# EAGLE schematic ME461_F28379D (EAGLE 7.7.0)

## Sheet 1 of 5
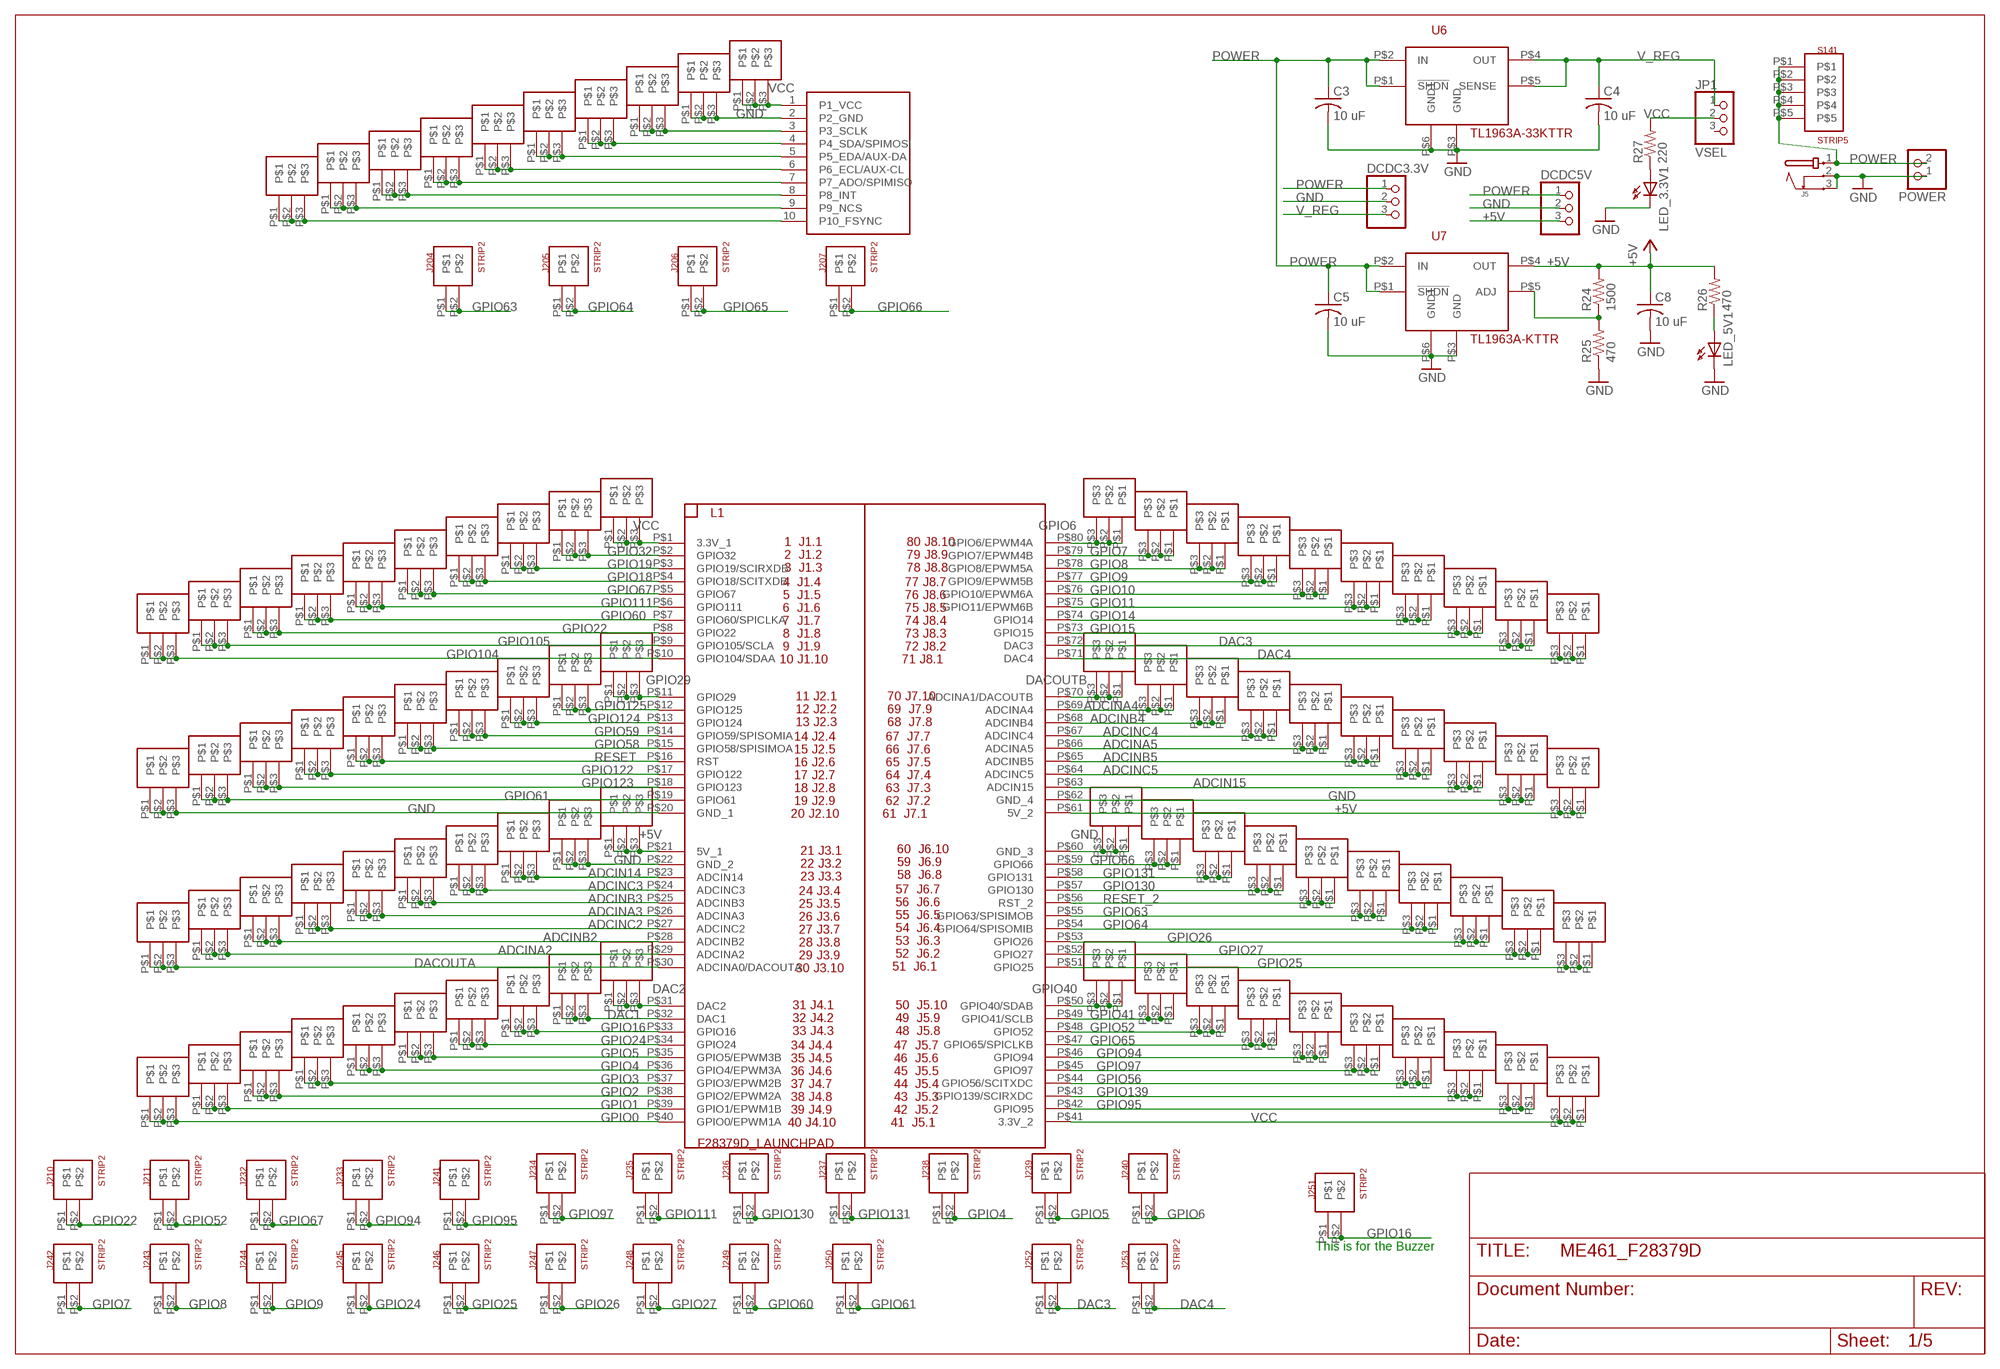
[diagram p0: schematic, sheet 1]

### Parts
C3  10 uF  C-USC1206  [C1206]
C4  10 uF  C-USC1206  [C1206]
C5  10 uF  C-USC1206  [C1206]
C8  10 uF  C-USC1206  [C1206]
DCDC3.3V  PINHD-1X3  [1X03]
DCDC5V  PINHD-1X3  [1X03]
J5  JACK-PMS  [JACK-PMS]
J10  STRIP3  [STRIP3]
J14  STRIP3  [STRIP3]
J15  STRIP3  [STRIP3]
J16  STRIP3  [STRIP3]
J17  STRIP3  [STRIP3]
J18  STRIP3  [STRIP3]
J19  STRIP3  [STRIP3]
J20  STRIP3  [STRIP3]
J21  STRIP3  [STRIP3]
J28  STRIP3  [STRIP3]
J29  STRIP3  [STRIP3]
J30  STRIP3  [STRIP3]
J31  STRIP3  [STRIP3]
J32  STRIP3  [STRIP3]
J33  STRIP3  [STRIP3]
J98  STRIP3  [STRIP3]
J99  STRIP3  [STRIP3]
J100  STRIP3  [STRIP3]
J101  STRIP3  [STRIP3]
J102  STRIP3  [STRIP3]
J103  STRIP3  [STRIP3]
J104  STRIP3  [STRIP3]
J105  STRIP3  [STRIP3]
J106  STRIP3  [STRIP3]
J107  STRIP3  [STRIP3]
J108  STRIP3  [STRIP3]
J109  STRIP3  [STRIP3]
J110  STRIP3  [STRIP3]
J111  STRIP3  [STRIP3]
J112  STRIP3  [STRIP3]
J113  STRIP3  [STRIP3]
J114  STRIP3  [STRIP3]
J115  STRIP3  [STRIP3]
J116  STRIP3  [STRIP3]
J117  STRIP3  [STRIP3]
J118  STRIP3  [STRIP3]
J119  STRIP3  [STRIP3]
J120  STRIP3  [STRIP3]
J121  STRIP3  [STRIP3]
J122  STRIP3  [STRIP3]
J123  STRIP3  [STRIP3]
J124  STRIP3  [STRIP3]
J125  STRIP3  [STRIP3]
J126  STRIP3  [STRIP3]
J127  STRIP3  [STRIP3]
J128  STRIP3  [STRIP3]
J129  STRIP3  [STRIP3]
J130  STRIP3  [STRIP3]
J131  STRIP3  [STRIP3]
J132  STRIP3  [STRIP3]
J133  STRIP3  [STRIP3]
J134  STRIP3  [STRIP3]
J135  STRIP3  [STRIP3]
J136  STRIP3  [STRIP3]
J137  STRIP3  [STRIP3]
J138  STRIP3  [STRIP3]
J139  STRIP3  [STRIP3]
J140  STRIP3  [STRIP3]
J141  STRIP3  [STRIP3]
J142  STRIP3  [STRIP3]
J143  STRIP3  [STRIP3]
J144  STRIP3  [STRIP3]
J145  STRIP3  [STRIP3]
J146  STRIP3  [STRIP3]
J147  STRIP3  [STRIP3]
J148  STRIP3  [STRIP3]
J149  STRIP3  [STRIP3]
J150  STRIP3  [STRIP3]
J151  STRIP3  [STRIP3]
J152  STRIP3  [STRIP3]
J153  STRIP3  [STRIP3]
J154  STRIP3  [STRIP3]
J155  STRIP3  [STRIP3]
J156  STRIP3  [STRIP3]
J157  STRIP3  [STRIP3]
J158  STRIP3  [STRIP3]
J159  STRIP3  [STRIP3]
J160  STRIP3  [STRIP3]
J161  STRIP3  [STRIP3]
J162  STRIP3  [STRIP3]
J163  STRIP3  [STRIP3]
J164  STRIP3  [STRIP3]
J165  STRIP3  [STRIP3]
J166  STRIP3  [STRIP3]
J167  STRIP3  [STRIP3]
J168  STRIP3  [STRIP3]
J169  STRIP3  [STRIP3]
J170  STRIP3  [STRIP3]
J176  STRIP3  [STRIP3]
J177  STRIP3  [STRIP3]
J204  STRIP2  [STRIP2]
J205  STRIP2  [STRIP2]
J206  STRIP2  [STRIP2]
J207  STRIP2  [STRIP2]
J210  STRIP2  [STRIP2]
J211  STRIP2  [STRIP2]
J232  STRIP2  [STRIP2]
J233  STRIP2  [STRIP2]
J234  STRIP2  [STRIP2]
J235  STRIP2  [STRIP2]
J236  STRIP2  [STRIP2]
J237  STRIP2  [STRIP2]
J238  STRIP2  [STRIP2]
J239  STRIP2  [STRIP2]
J240  STRIP2  [STRIP2]
J241  STRIP2  [STRIP2]
J242  STRIP2  [STRIP2]
J243  STRIP2  [STRIP2]
J244  STRIP2  [STRIP2]
J245  STRIP2  [STRIP2]
J246  STRIP2  [STRIP2]
J247  STRIP2  [STRIP2]
J248  STRIP2  [STRIP2]
J249  STRIP2  [STRIP2]
J250  STRIP2  [STRIP2]
J251  STRIP2  [STRIP2]
J252  STRIP2  [STRIP2]
J253  STRIP2  [STRIP2]
JP1  VSEL  PINHD-1X3  [1X03]
L1  F28379D_LAUNCHPAD  [F28379D_LAUNCHPAD]
LED_3.3V1  LED3MM  [LED3MM]
LED_5V1  LED3MM  [LED3MM]
POWER  PINHD-1X2  [1X02]
R24  1500  R-US_M1206  [M1206]
R25  470  R-US_M1206  [M1206]
R26  470  R-US_M1206  [M1206]
R27  220  R-US_M1206  [M1206]
S141  STRIP5  [STRIP5]
U6  TL1963A-33KTTR  [TL1963AKTTR]
U7  TL1963A-KTTR  [TL1963AKTTR]
U$1  MPU-9250-BB  [MPU-9250-BB]

### Nets
+5V [supply]: C8.1 DCDC5V.3 J103.P$1 J103.P$2 J103.P$3 J152.P$1 J152.P$2 J152.P$3 L1.P$21(5V_1) L1.P$61(5V_2) R24.2 R26.2 U7.P$4(OUT) ; also sheet 2,3,5
ADCIN14: J105.P$1 J105.P$2 J105.P$3 L1.P$23(ADCIN14)
ADCIN15: J150.P$1 J150.P$2 J150.P$3 L1.P$63(ADCIN15)
ADCINA2: J111.P$1 J111.P$2 J111.P$3 L1.P$29(ADCINA2)
ADCINA3: J108.P$1 J108.P$2 J108.P$3 L1.P$26(ADCINA3)
ADCINA4: J144.P$1 J144.P$2 J144.P$3 L1.P$69(ADCINA4)
ADCINA5: J147.P$1 J147.P$2 J147.P$3 L1.P$66(ADCINA5)
ADCINB2: J110.P$1 J110.P$2 J110.P$3 L1.P$28(ADCINB2)
ADCINB3: J107.P$1 J107.P$2 J107.P$3 L1.P$25(ADCINB3)
ADCINB4: J145.P$1 J145.P$2 J145.P$3 L1.P$68(ADCINB4)
ADCINB5: J148.P$1 J148.P$2 J148.P$3 L1.P$65(ADCINB5)
ADCINC2: J109.P$1 J109.P$2 J109.P$3 L1.P$27(ADCINC2)
ADCINC3: J106.P$1 J106.P$2 J106.P$3 L1.P$24(ADCINC3)
ADCINC4: J146.P$1 J146.P$2 J146.P$3 L1.P$67(ADCINC4)
ADCINC5: J149.P$1 J149.P$2 J149.P$3 L1.P$64(ADCINC5)
DAC1: J114.P$1 J114.P$2 J114.P$3 L1.P$32(DAC1)
DAC2: J113.P$1 J113.P$2 J113.P$3 L1.P$31(DAC2)
DAC3: J141.P$1 J141.P$2 J141.P$3 J252.P$1 J252.P$2 L1.P$72(DAC3)
DAC4: J142.P$1 J142.P$2 J142.P$3 J253.P$1 J253.P$2 L1.P$71(DAC4)
DACOUTA: J112.P$1 J112.P$2 J112.P$3 L1.P$30(ADCINA0/DACOUTA)
DACOUTB: J143.P$1 J143.P$2 J143.P$3 L1.P$70(ADCINA1/DACOUTB)
GND [supply]: C3.2 C4.2 C5.2 C8.2 DCDC3.3V.2 DCDC5V.2 J5.2 J5.3 J102.P$1 J102.P$2 J102.P$3 J104.P$1 J104.P$2 J104.P$3 J124.P$1 J124.P$2 J124.P$3 J151.P$1 J151.P$2 J151.P$3 J153.P$1 J153.P$2 J153.P$3 L1.P$20(GND_1) L1.P$22(GND_2) L1.P$60(GND_3) L1.P$62(GND_4) LED_3.3V1.K(C) LED_5V1.K(C) POWER.1 R25.1 U6.P$3(GND) U6.P$6(GND1) U7.P$3(GND) U7.P$6(GND1) U$1.2(P2_GND) ; also sheet 2,3,4,5
GPIO0: J122.P$1 J122.P$2 J122.P$3 L1.P$40(GPIO0/EPWM1A)
GPIO1: J121.P$1 J121.P$2 J121.P$3 L1.P$39(GPIO1/EPWM1B)
GPIO2: J120.P$1 J120.P$2 J120.P$3 L1.P$38(GPIO2/EPWM2A) ; also sheet 3
GPIO3: J119.P$1 J119.P$2 J119.P$3 L1.P$37(GPIO3/EPWM2B) ; also sheet 3
GPIO4: J118.P$1 J118.P$2 J118.P$3 J238.P$1 J238.P$2 L1.P$36(GPIO4/EPWM3A)
GPIO5: J117.P$1 J117.P$2 J117.P$3 J239.P$1 J239.P$2 L1.P$35(GPIO5/EPWM3B)
GPIO6: J133.P$1 J133.P$2 J133.P$3 J240.P$1 J240.P$2 L1.P$80(GPIO6/EPWM4A)
GPIO7: J134.P$1 J134.P$2 J134.P$3 J242.P$1 J242.P$2 L1.P$79(GPIO7/EPWM4B)
GPIO8: J135.P$1 J135.P$2 J135.P$3 J243.P$1 J243.P$2 L1.P$78(GPIO8/EPWM5A)
GPIO9: J136.P$1 J136.P$2 J136.P$3 J244.P$1 J244.P$2 L1.P$77(GPIO9/EPWM5B)
GPIO10: J137.P$1 J137.P$2 J137.P$3 L1.P$76(GPIO10/EPWM6A) ; also sheet 3
GPIO11: J138.P$1 J138.P$2 J138.P$3 L1.P$75(GPIO11/EPWM6B) ; also sheet 3
GPIO14: J139.P$1 J139.P$2 J139.P$3 L1.P$74(GPIO14) ; also sheet 3
GPIO15: J140.P$1 J140.P$2 J140.P$3 L1.P$73(GPIO15) ; also sheet 3
GPIO16: J115.P$1 J115.P$2 J115.P$3 J251.P$1 J251.P$2 L1.P$33(GPIO16)
GPIO18: J16.P$1 J16.P$2 J16.P$3 L1.P$4(GPIO18/SCITXDB)
GPIO19: J15.P$1 J15.P$2 J15.P$3 L1.P$3(GPIO19/SCIRXDB)
GPIO22: J20.P$1 J20.P$2 J20.P$3 J210.P$1 J210.P$2 L1.P$8(GPIO22)
GPIO24: J116.P$1 J116.P$2 J116.P$3 J245.P$1 J245.P$2 L1.P$34(GPIO24)
GPIO25: J162.P$1 J162.P$2 J162.P$3 J246.P$1 J246.P$2 L1.P$51(GPIO25)
GPIO26: J160.P$1 J160.P$2 J160.P$3 J247.P$1 J247.P$2 L1.P$53(GPIO26)
GPIO27: J161.P$1 J161.P$2 J161.P$3 J248.P$1 J248.P$2 L1.P$52(GPIO27)
GPIO29: J29.P$1 J29.P$2 J29.P$3 L1.P$11(GPIO29) ; also sheet 3
GPIO32: J14.P$1 J14.P$2 J14.P$3 L1.P$2(GPIO32) ; also sheet 3
GPIO40: J163.P$1 J163.P$2 J163.P$3 L1.P$50(GPIO40/SDAB) ; also sheet 4
GPIO41: J164.P$1 J164.P$2 J164.P$3 L1.P$49(GPIO41/SCLB) ; also sheet 4
GPIO52: J165.P$1 J165.P$2 J165.P$3 J211.P$1 J211.P$2 L1.P$48(GPIO52)
GPIO56: J169.P$1 J169.P$2 J169.P$3 L1.P$44(GPIO56/SCITXDC)
GPIO58: J33.P$1 J33.P$2 J33.P$3 L1.P$15(GPIO58/SPISIMOA)
GPIO59: J32.P$1 J32.P$2 J32.P$3 L1.P$14(GPIO59/SPISOMIA)
GPIO60: J19.P$1 J19.P$2 J19.P$3 J249.P$1 J249.P$2 L1.P$7(GPIO60/SPICLKA)
GPIO61: J101.P$1 J101.P$2 J101.P$3 J250.P$1 J250.P$2 L1.P$19(GPIO61)
GPIO63: J158.P$1 J158.P$2 J158.P$3 J204.P$1 J204.P$2 L1.P$55(GPIO63/SPISIMOB)
GPIO64: J159.P$1 J159.P$2 J159.P$3 J205.P$1 J205.P$2 L1.P$54(GPIO64/SPISOMIB)
GPIO65: J166.P$1 J166.P$2 J166.P$3 J206.P$1 J206.P$2 L1.P$47(GPIO65/SPICLKB)
GPIO66: J154.P$1 J154.P$2 J154.P$3 J207.P$1 J207.P$2 L1.P$59(GPIO66)
GPIO67: J17.P$1 J17.P$2 J17.P$3 J232.P$1 J232.P$2 L1.P$5(GPIO67)
GPIO94: J167.P$1 J167.P$2 J167.P$3 J233.P$1 J233.P$2 L1.P$46(GPIO94)
GPIO95: J176.P$1 J176.P$2 J176.P$3 J241.P$1 J241.P$2 L1.P$42(GPIO95)
GPIO97: J168.P$1 J168.P$2 J168.P$3 J234.P$1 J234.P$2 L1.P$45(GPIO97)
GPIO104: J28.P$1 J28.P$2 J28.P$3 L1.P$10(GPIO104/SDAA)
GPIO105: J21.P$1 J21.P$2 J21.P$3 L1.P$9(GPIO105/SCLA)
GPIO111: J18.P$1 J18.P$2 J18.P$3 J235.P$1 J235.P$2 L1.P$6(GPIO111)
GPIO122: J99.P$1 J99.P$2 J99.P$3 L1.P$17(GPIO122) ; also sheet 5
GPIO123: J100.P$1 J100.P$2 J100.P$3 L1.P$18(GPIO123) ; also sheet 5
GPIO124: J31.P$1 J31.P$2 J31.P$3 L1.P$13(GPIO124) ; also sheet 5
GPIO125: J30.P$1 J30.P$2 J30.P$3 L1.P$12(GPIO125) ; also sheet 5
GPIO130: J156.P$1 J156.P$2 J156.P$3 J236.P$1 J236.P$2 L1.P$57(GPIO130)
GPIO131: J155.P$1 J155.P$2 J155.P$3 J237.P$1 J237.P$2 L1.P$58(GPIO131)
GPIO139: J170.P$1 J170.P$2 J170.P$3 L1.P$43(GPIO139/SCIRXDC)
N$104: R24.1 R25.2 U7.P$5(ADJ)
N$114: LED_5V1.A R26.1
N$117: LED_3.3V1.A R27.1
N$335: J125.P$1 J125.P$2 J125.P$3 U$1.3(P3_SCLK)
N$336: J126.P$1 J126.P$2 J126.P$3 U$1.4(P4_SDA/SPIMOSI)
N$337: J127.P$1 J127.P$2 J127.P$3 U$1.5(P5_EDA/AUX-DA)
N$338: J128.P$1 J128.P$2 J128.P$3 U$1.6(P6_ECL/AUX-CL)
N$339: J129.P$1 J129.P$2 J129.P$3 U$1.7(P7_ADO/SPIMISO)
N$340: J130.P$1 J130.P$2 J130.P$3 U$1.8(P8_INT)
N$341: J131.P$1 J131.P$2 J131.P$3 U$1.9(P9_NCS)
N$342: J132.P$1 J132.P$2 J132.P$3 U$1.10(P10_FSYNC)
POWER [supply]: C3.1 C5.1 DCDC3.3V.1 DCDC5V.1 J5.1 POWER.2 S141.P$1 S141.P$2 S141.P$3 S141.P$4 S141.P$5 U6.P$1(!SHDN) U6.P$2(IN) U7.P$1(!SHDN) U7.P$2(IN) ; also sheet 3,5
RESET: J98.P$1 J98.P$2 J98.P$3 L1.P$16(RST)
RESET_2: J157.P$1 J157.P$2 J157.P$3 L1.P$56(RST_2)
V_REG [supply]: C4.1 DCDC3.3V.3 JP1.1 U6.P$4(OUT) U6.P$5(SENSE)
VCC [supply]: J10.P$1 J10.P$2 J10.P$3 J123.P$1 J123.P$2 J123.P$3 J177.P$1 J177.P$2 J177.P$3 JP1.2 L1.P$1(3.3V_1) L1.P$41(3.3V_2) R27.2 U$1.1(P1_VCC) ; also sheet 2,3,4,5
Unconnected: JP1.3

### Notes on the sheet
- This is for the Buzzer

## Sheet 2 of 5
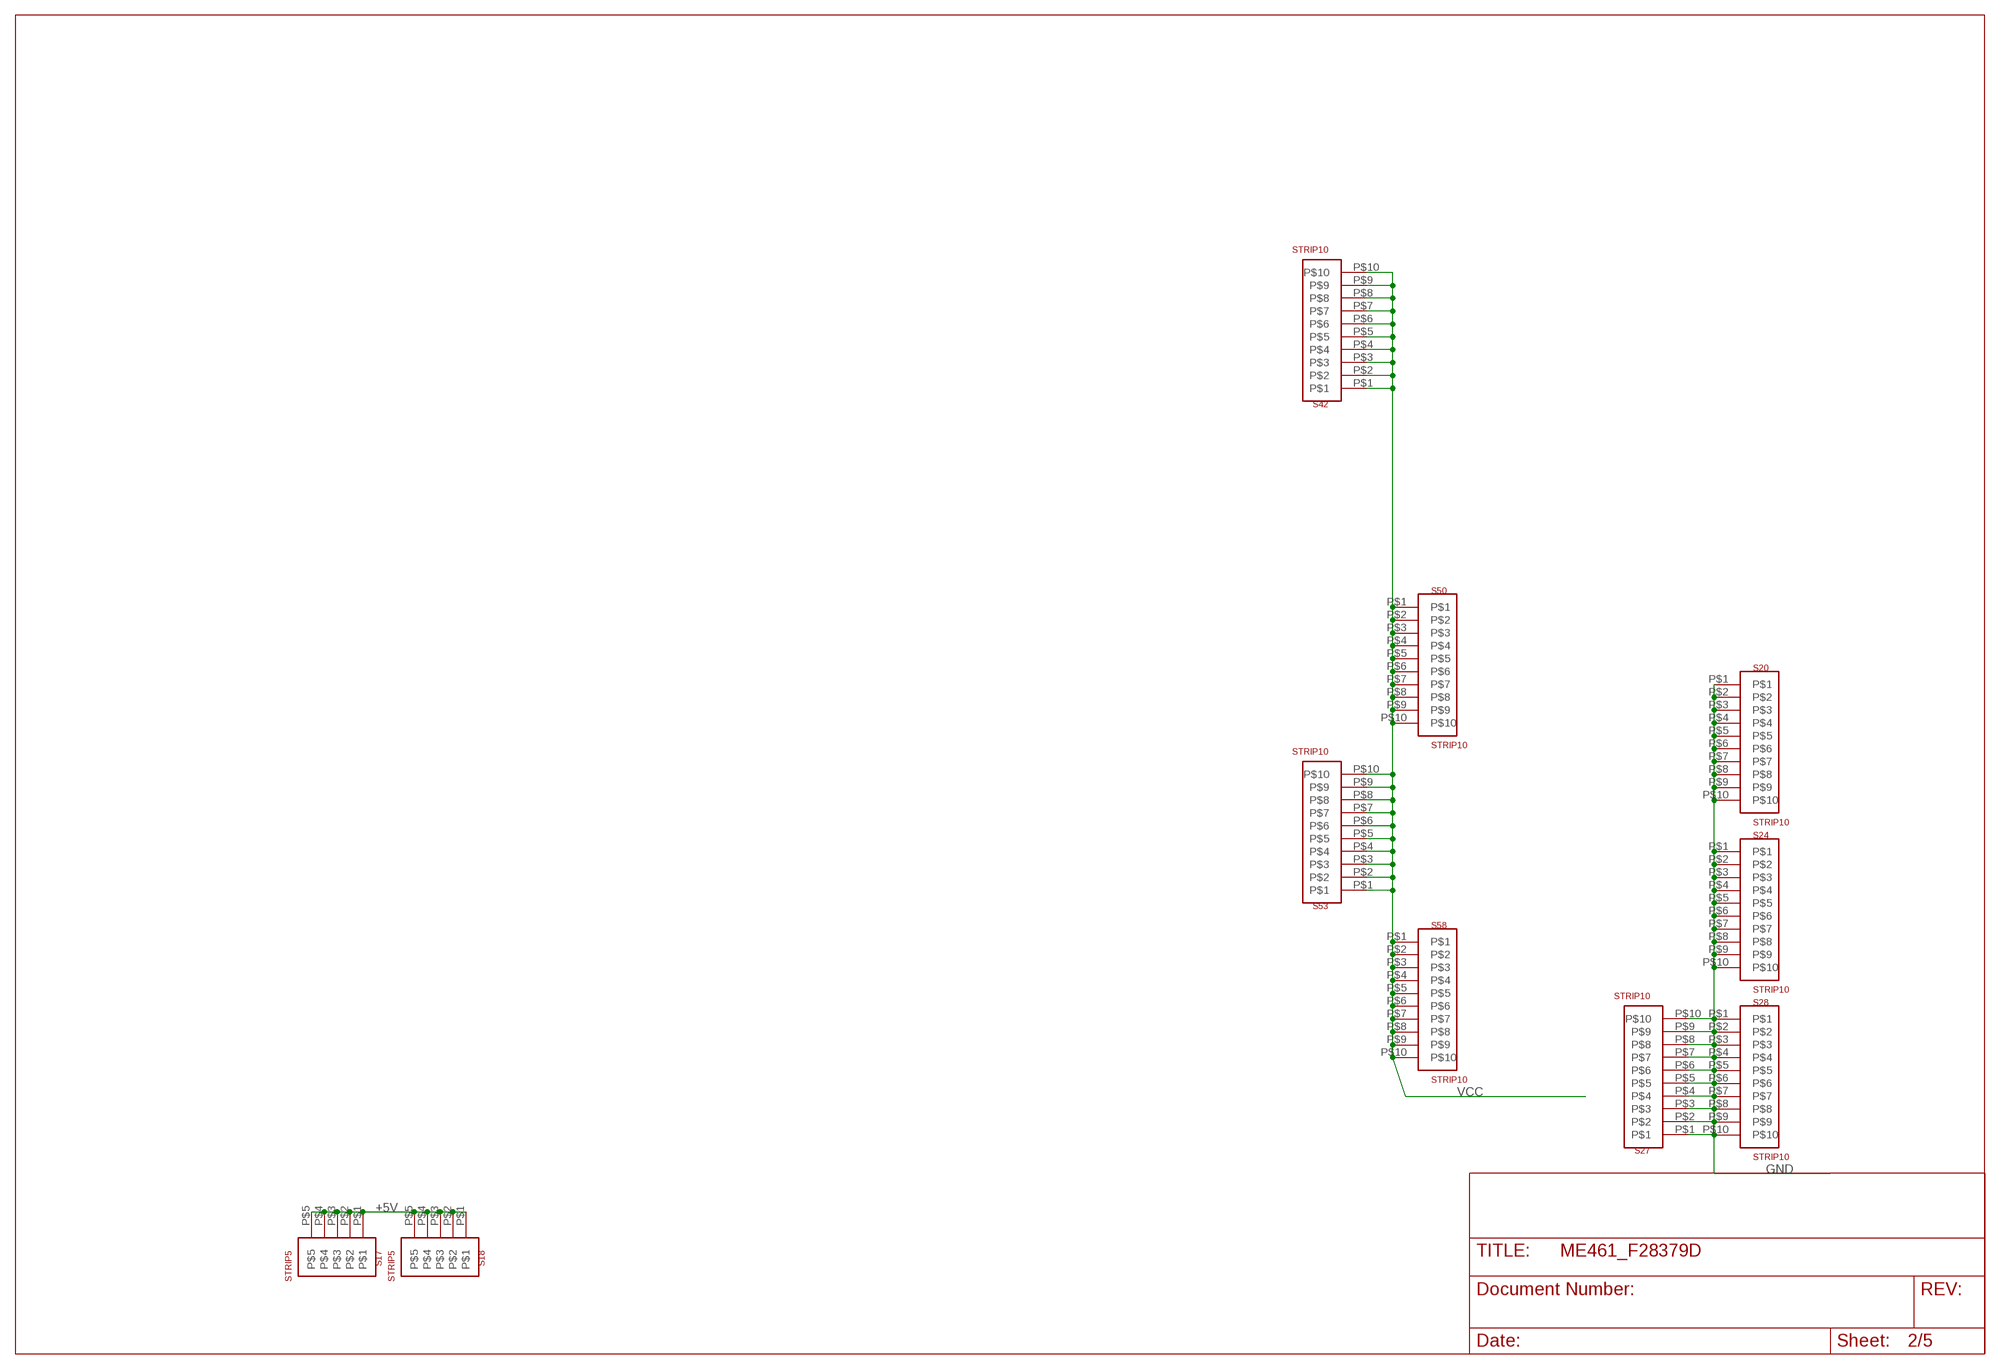
[diagram p1: schematic, sheet 2]

### Parts
S17  STRIP5  [STRIP5]
S18  STRIP5  [STRIP5]
S20  STRIP10  [STRIP10]
S24  STRIP10  [STRIP10]
S27  STRIP10  [STRIP10]
S28  STRIP10  [STRIP10]
S42  STRIP10  [STRIP10]
S50  STRIP10  [STRIP10]
S53  STRIP10  [STRIP10]
S58  STRIP10  [STRIP10]

### Nets
+5V [supply]: S17.P$1 S17.P$2 S17.P$3 S17.P$4 S17.P$5 S18.P$1 S18.P$2 S18.P$3 S18.P$4 S18.P$5 ; also sheet 1,3,5
GND [supply]: S20.P$1 S20.P$2 S20.P$3 S20.P$4 S20.P$5 S20.P$6 S20.P$7 S20.P$8 S20.P$9 S20.P$10 S24.P$1 S24.P$2 S24.P$3 S24.P$4 S24.P$5 S24.P$6 S24.P$7 S24.P$8 S24.P$9 S24.P$10 S27.P$1 S27.P$2 S27.P$3 S27.P$4 S27.P$5 S27.P$6 S27.P$7 S27.P$8 S27.P$9 S27.P$10 S28.P$1 S28.P$2 S28.P$3 S28.P$4 S28.P$5 S28.P$6 S28.P$7 S28.P$8 S28.P$9 S28.P$10 ; also sheet 1,3,4,5
VCC [supply]: S42.P$1 S42.P$2 S42.P$3 S42.P$4 S42.P$5 S42.P$6 S42.P$7 S42.P$8 S42.P$9 S42.P$10 S50.P$1 S50.P$2 S50.P$3 S50.P$4 S50.P$5 S50.P$6 S50.P$7 S50.P$8 S50.P$9 S50.P$10 S53.P$1 S53.P$2 S53.P$3 S53.P$4 S53.P$5 S53.P$6 S53.P$7 S53.P$8 S53.P$9 S53.P$10 S58.P$1 S58.P$2 S58.P$3 S58.P$4 S58.P$5 S58.P$6 S58.P$7 S58.P$8 S58.P$9 S58.P$10 ; also sheet 1,3,4,5

## Sheet 3 of 5
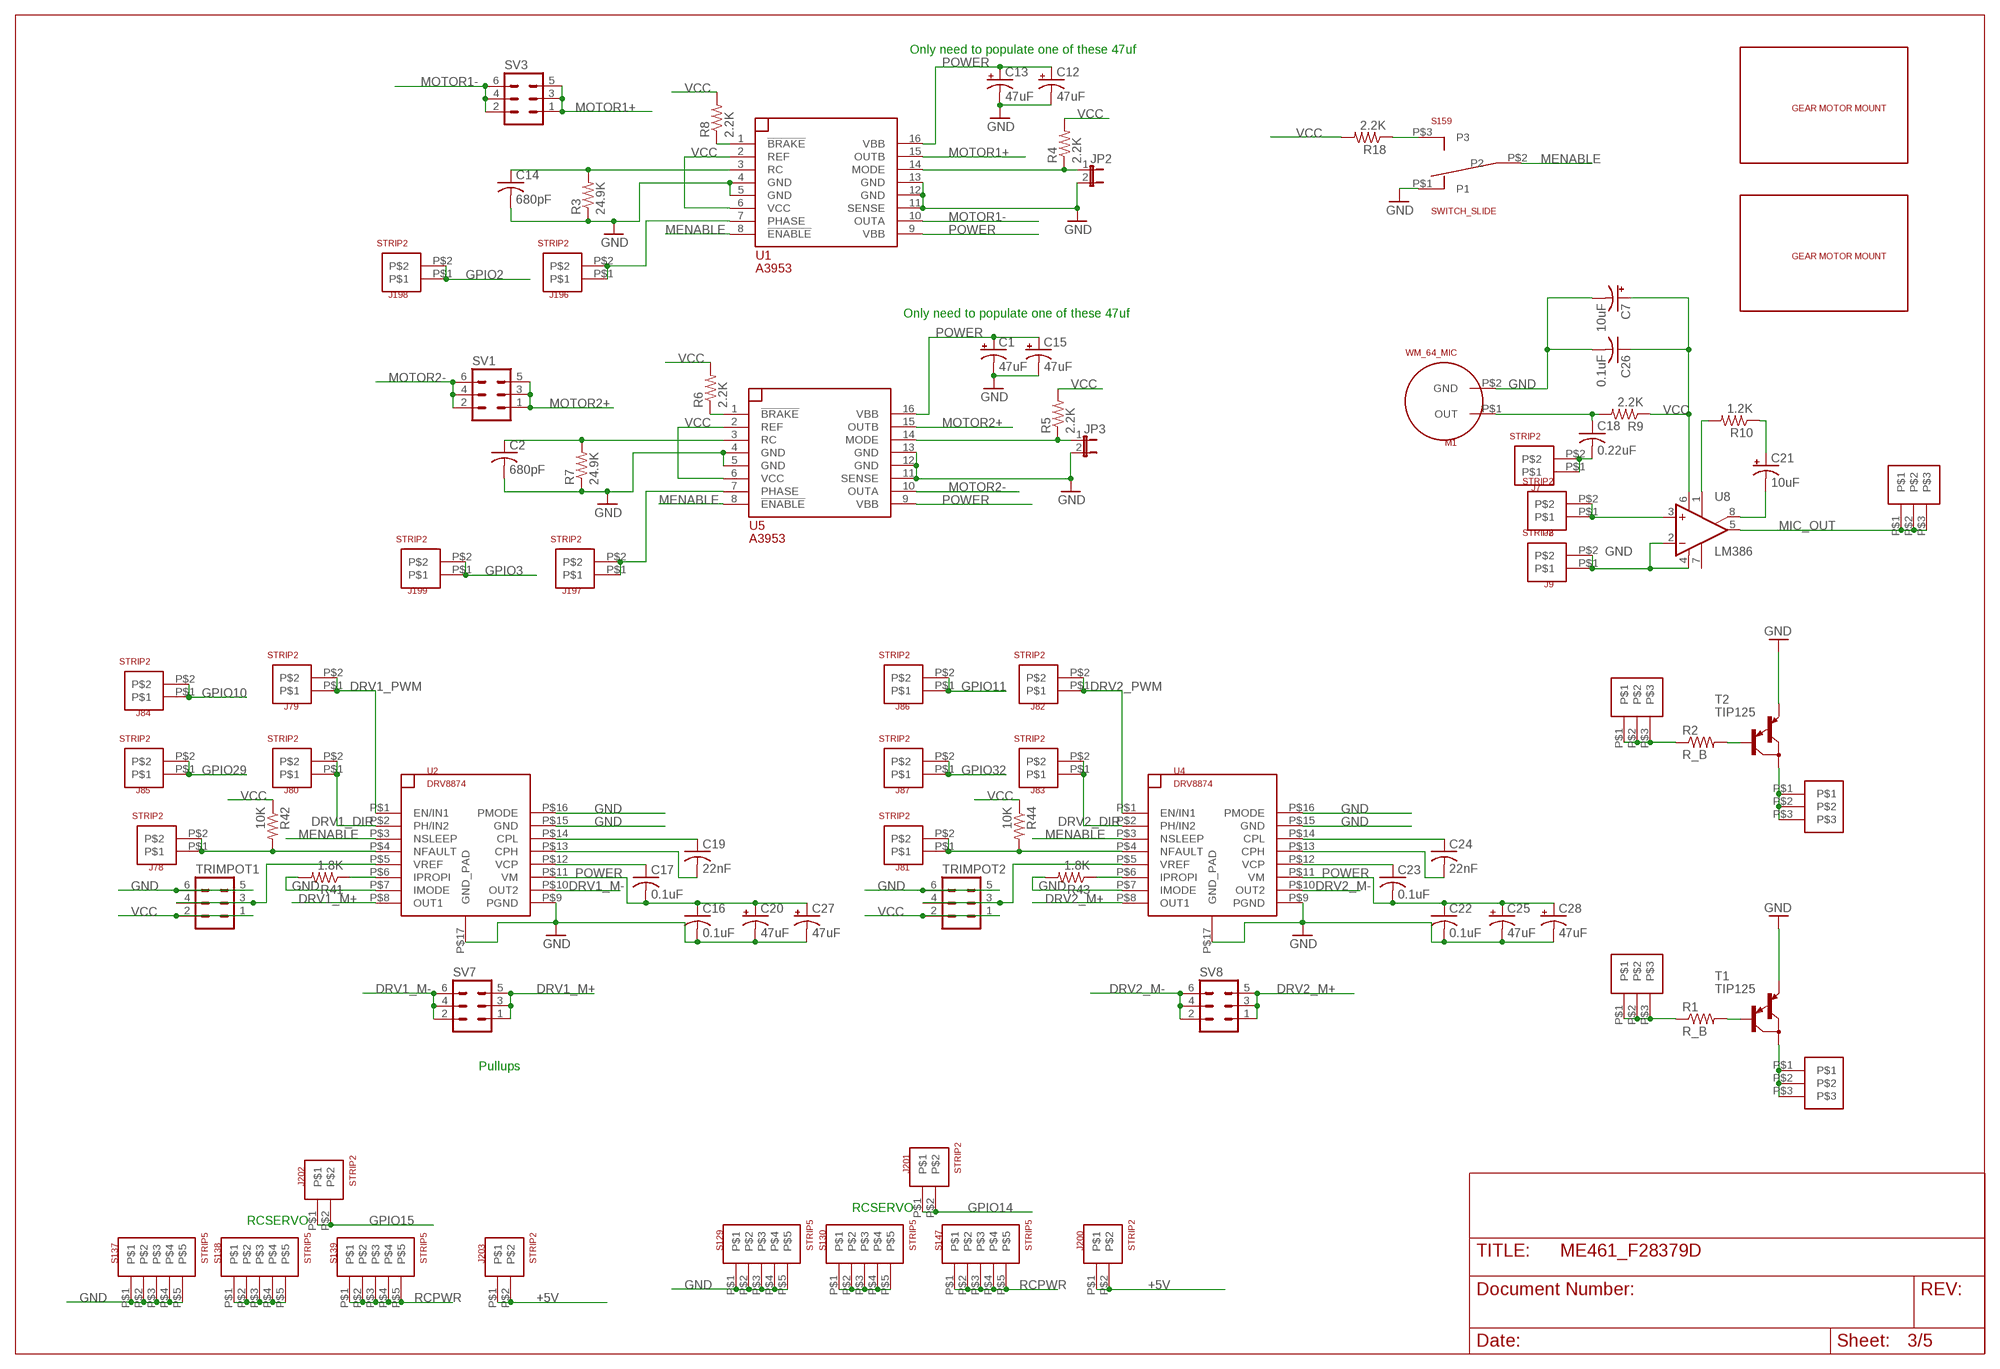
[diagram p2: schematic, sheet 3]

### Parts
C1  47uF  CPOL-US153CLV-0810  [153CLV-0810]
C2  680pF  C-USC1206  [C1206]
C7  10uF  CPOL-USE2.5-6  [E2,5-6]
C12  47uF  CPOL-US153CLV-0810  [153CLV-0810]
C13  47uF  CPOL-US153CLV-0810  [153CLV-0810]
C14  680pF  C-USC1206  [C1206]
C15  47uF  CPOL-US153CLV-0810  [153CLV-0810]
C16  0.1uF  C-USC1206  [C1206]
C17  0.1uF  C-USC1206  [C1206]
C18  0.22uF  C-US050-025X075  [C050-025X075]
C19  22nF  C-USC1206  [C1206]
C20  47uF  CPOL-US153CLV-0810  [153CLV-0810]
C21  10uF  CPOL-USE2.5-6  [E2,5-6]
C22  0.1uF  C-USC1206  [C1206]
C23  0.1uF  C-USC1206  [C1206]
C24  22nF  C-USC1206  [C1206]
C25  47uF  CPOL-US153CLV-0810  [153CLV-0810]
C26  0.1uF  C-US050-025X075  [C050-025X075]
C27  47uF  CPOL-US153CLV-0810  [153CLV-0810]
C28  47uF  CPOL-US153CLV-0810  [153CLV-0810]
J4  STRIP3  [STRIP3]
J6  STRIP3  [STRIP3]
J7  STRIP2  [STRIP2]
J8  STRIP2  [STRIP2]
J9  STRIP2  [STRIP2]
J23  STRIP3  [STRIP3]
J24  STRIP3  [STRIP3]
J49  STRIP3  [STRIP3]
J78  STRIP2  [STRIP2]
J79  STRIP2  [STRIP2]
J80  STRIP2  [STRIP2]
J81  STRIP2  [STRIP2]
J82  STRIP2  [STRIP2]
J83  STRIP2  [STRIP2]
J84  STRIP2  [STRIP2]
J85  STRIP2  [STRIP2]
J86  STRIP2  [STRIP2]
J87  STRIP2  [STRIP2]
J196  STRIP2  [STRIP2]
J197  STRIP2  [STRIP2]
J198  STRIP2  [STRIP2]
J199  STRIP2  [STRIP2]
J200  STRIP2  [STRIP2]
J201  STRIP2  [STRIP2]
J202  STRIP2  [STRIP2]
J203  STRIP2  [STRIP2]
JP2  JP1E  [JP1]
JP3  JP1E  [JP1]
M1  WM_64_MIC  [WM_64_MIC]
R1  R_B  R-US_0207/10  [0207/10]
R2  R_B  R-US_0207/10  [0207/10]
R3  24.9K  R-US_M1206  [M1206]
R4  2.2K  R-US_M1206  [M1206]
R5  2.2K  R-US_M1206  [M1206]
R6  2.2K  R-US_M1206  [M1206]
R7  24.9K  R-US_M1206  [M1206]
R8  2.2K  R-US_M1206  [M1206]
R9  2.2K  R-US_0207/10  [0207/10]
R10  1.2K  R-US_0207/10  [0207/10]
R18  2.2K  R-US_M1206  [M1206]
R41  1.8K  R-US_M1206  [M1206]
R42  10K  R-US_M1206  [M1206]
R43  1.8K  R-US_M1206  [M1206]
R44  10K  R-US_M1206  [M1206]
S129  STRIP5  [STRIP5]
S130  STRIP5  [STRIP5]
S137  STRIP5  [STRIP5]
S138  STRIP5  [STRIP5]
S139  STRIP5  [STRIP5]
S147  STRIP5  [STRIP5]
S159  SWITCH_SLIDE  [SWITCH_SLIDE]
SV1  MA03-2  [MA03-2]
SV3  MA03-2  [MA03-2]
SV7  MA03-2  [MA03-2]
SV8  MA03-2  [MA03-2]
T1  TIP125  [TO220]
T2  TIP125  [TO220]
TRIMPOT1  MA03-2  [MA03-2]
TRIMPOT2  MA03-2  [MA03-2]
U1  A3953  [SO16W]
U2  DRV8874  [HTSSOP16]
U4  DRV8874  [HTSSOP16]
U5  A3953  [SO16W]
U8  LM386  [DIL08]
U$2  GEARMOTOR_MOUNT  [GEARMOTOR_MOUNT]
U$3  GEARMOTOR_MOUNT  [GEARMOTOR_MOUNT]

### Nets
+5V [supply]: J200.P$1 J200.P$2 J203.P$1 J203.P$2 ; also sheet 1,2,5
DRV1_DIR: J80.P$1 J80.P$2 U2.P$2(PH/IN2)
DRV1_M+: SV7.1 SV7.3 SV7.5 U2.P$8(OUT1)
DRV1_M-: SV7.2 SV7.4 SV7.6 U2.P$10(OUT2)
DRV1_PWM: J79.P$1 J79.P$2 U2.P$1(EN/IN1)
DRV2_DIR: J83.P$1 J83.P$2 U4.P$2(PH/IN2)
DRV2_M+: SV8.1 SV8.3 SV8.5 U4.P$8(OUT1)
DRV2_M-: SV8.2 SV8.4 SV8.6 U4.P$10(OUT2)
DRV2_PWM: J82.P$1 J82.P$2 U4.P$1(EN/IN1)
GND [supply]: C1.- C2.2 C7.- C12.- C13.- C14.2 C15.- C16.2 C20.- C22.2 C25.- C26.2 C27.- C28.- J9.P$1 J9.P$2 JP2.2 JP3.2 M1.P$2(GND) R3.1 R7.1 R41.2 R43.2 S129.P$1 S129.P$2 S129.P$3 S129.P$4 S129.P$5 S137.P$1 S137.P$2 S137.P$3 S137.P$4 S137.P$5 S159.P$1(P1) T1.3(E) T2.3(E) TRIMPOT1.5 TRIMPOT1.6 TRIMPOT2.5 TRIMPOT2.6 U1.4(GND) U1.5(GND) U1.11(SENSE) U1.12(GND) U1.13(GND) U2.P$7(IMODE) U2.P$9(PGND) U2.P$15(GND) U2.P$16(PMODE) U2.P$17(GND_PAD) U4.P$7(IMODE) U4.P$9(PGND) U4.P$15(GND) U4.P$16(PMODE) U4.P$17(GND_PAD) U5.4(GND) U5.5(GND) U5.11(SENSE) U5.12(GND) U5.13(GND) U8.2(-IN) U8.4(GND) ; also sheet 1,2,4,5
GPIO2: J198.P$1 J198.P$2 ; also sheet 1
GPIO3: J199.P$1 J199.P$2 ; also sheet 1
GPIO10: J84.P$1 J84.P$2 ; also sheet 1
GPIO11: J86.P$1 J86.P$2 ; also sheet 1
GPIO14: J201.P$1 J201.P$2 ; also sheet 1
GPIO15: J202.P$1 J202.P$2 ; also sheet 1
GPIO29: J85.P$1 J85.P$2 ; also sheet 1
GPIO32: J87.P$1 J87.P$2 ; also sheet 1
MENABLE: S159.P$2(P2) U1.8(!ENABLE) U2.P$3(NSLEEP) U4.P$3(NSLEEP) U5.8(!ENABLE)
MIC_OUT: J49.P$1 J49.P$2 J49.P$3 U8.5(OUT)
MOTOR1+ [supply]: SV3.1 SV3.3 SV3.5 U1.15(OUTB)
MOTOR1- [supply]: SV3.2 SV3.4 SV3.6 U1.10(OUTA)
MOTOR2+ [supply]: SV1.1 SV1.3 SV1.5 U5.15(OUTB)
MOTOR2- [supply]: SV1.2 SV1.4 SV1.6 U5.10(OUTA)
N$31: R2.2 T2.1(B)
N$87: R1.2 T1.1(B)
N$88: S138.P$1 S138.P$2 S138.P$3 S138.P$4 S138.P$5
N$90: C21.- U8.8(GAIN2)
N$91: R10.2 U8.1(GAIN1)
N$92: C21.+ R10.1
N$93: C18.2 J7.P$1 J7.P$2
N$94: C18.1 M1.P$1(OUT) R9.2
N$125: R6.1 U5.1(!BRAKE)
N$127: C2.1 R7.2 U5.3(RC)
N$129: R8.1 U1.1(!BRAKE)
N$130: C14.1 R3.2 U1.3(RC)
N$131: JP2.1 R4.1 U1.14(MODE)
N$132: R18.1 S159.P$3(P3)
N$133: JP3.1 R5.1 U5.14(MODE)
N$175: C19.1 U2.P$14(CPL)
N$176: C19.2 U2.P$13(CPH)
N$177: C17.1 U2.P$12(VCP)
N$178: R43.1 U4.P$6(IPROPI)
N$179: R41.1 U2.P$6(IPROPI)
N$186: J78.P$1 J78.P$2 R42.2 U2.P$4(NFAULT)
N$187: TRIMPOT1.3 TRIMPOT1.4 U2.P$5(VREF)
N$188: C24.1 U4.P$14(CPL)
N$189: C24.2 U4.P$13(CPH)
N$190: C23.1 U4.P$12(VCP)
N$191: J81.P$1 J81.P$2 R44.2 U4.P$4(NFAULT)
N$192: TRIMPOT2.3 TRIMPOT2.4 U4.P$5(VREF)
N$407: S130.P$1 S130.P$2 S130.P$3 S130.P$4 S130.P$5
N$408: J8.P$1 J8.P$2 U8.3(+IN)
N$414: J196.P$1 J196.P$2 U1.7(PHASE)
N$425: J197.P$1 J197.P$2 U5.7(PHASE)
POWER [supply]: C1.+ C12.+ C13.+ C15.+ C16.1 C17.2 C20.+ C22.1 C23.2 C25.+ C27.+ C28.+ U1.9(VBB) U1.16(VBB) U2.P$11(VM) U4.P$11(VM) U5.9(VBB) U5.16(VBB) ; also sheet 1,5
RCPWR: S139.P$1 S139.P$2 S139.P$3 S139.P$4 S139.P$5 S147.P$1 S147.P$2 S147.P$3 S147.P$4 S147.P$5
TR_BASE: J6.P$1 J6.P$2 J6.P$3 R1.1
TR_BASE1: J24.P$1 J24.P$2 J24.P$3 R2.1
TR_LOAD: J4.P$1 J4.P$2 J4.P$3 T1.2(C)
TR_LOAD1: J23.P$1 J23.P$2 J23.P$3 T2.2(C)
VCC [supply]: C7.+ C26.1 R4.2 R5.2 R6.2 R8.2 R9.1 R18.2 R42.1 R44.1 TRIMPOT1.1 TRIMPOT1.2 TRIMPOT2.1 TRIMPOT2.2 U1.2(REF) U1.6(VCC) U5.2(REF) U5.6(VCC) U8.6(VS) ; also sheet 1,2,4,5
Unconnected: U8.7(BYPASS)

### Notes on the sheet
- Only need to populate one of these 47uf
- Only need to populate one of these 47uf
- Pullups
- RCSERVO
- RCSERVO

## Sheet 4 of 5
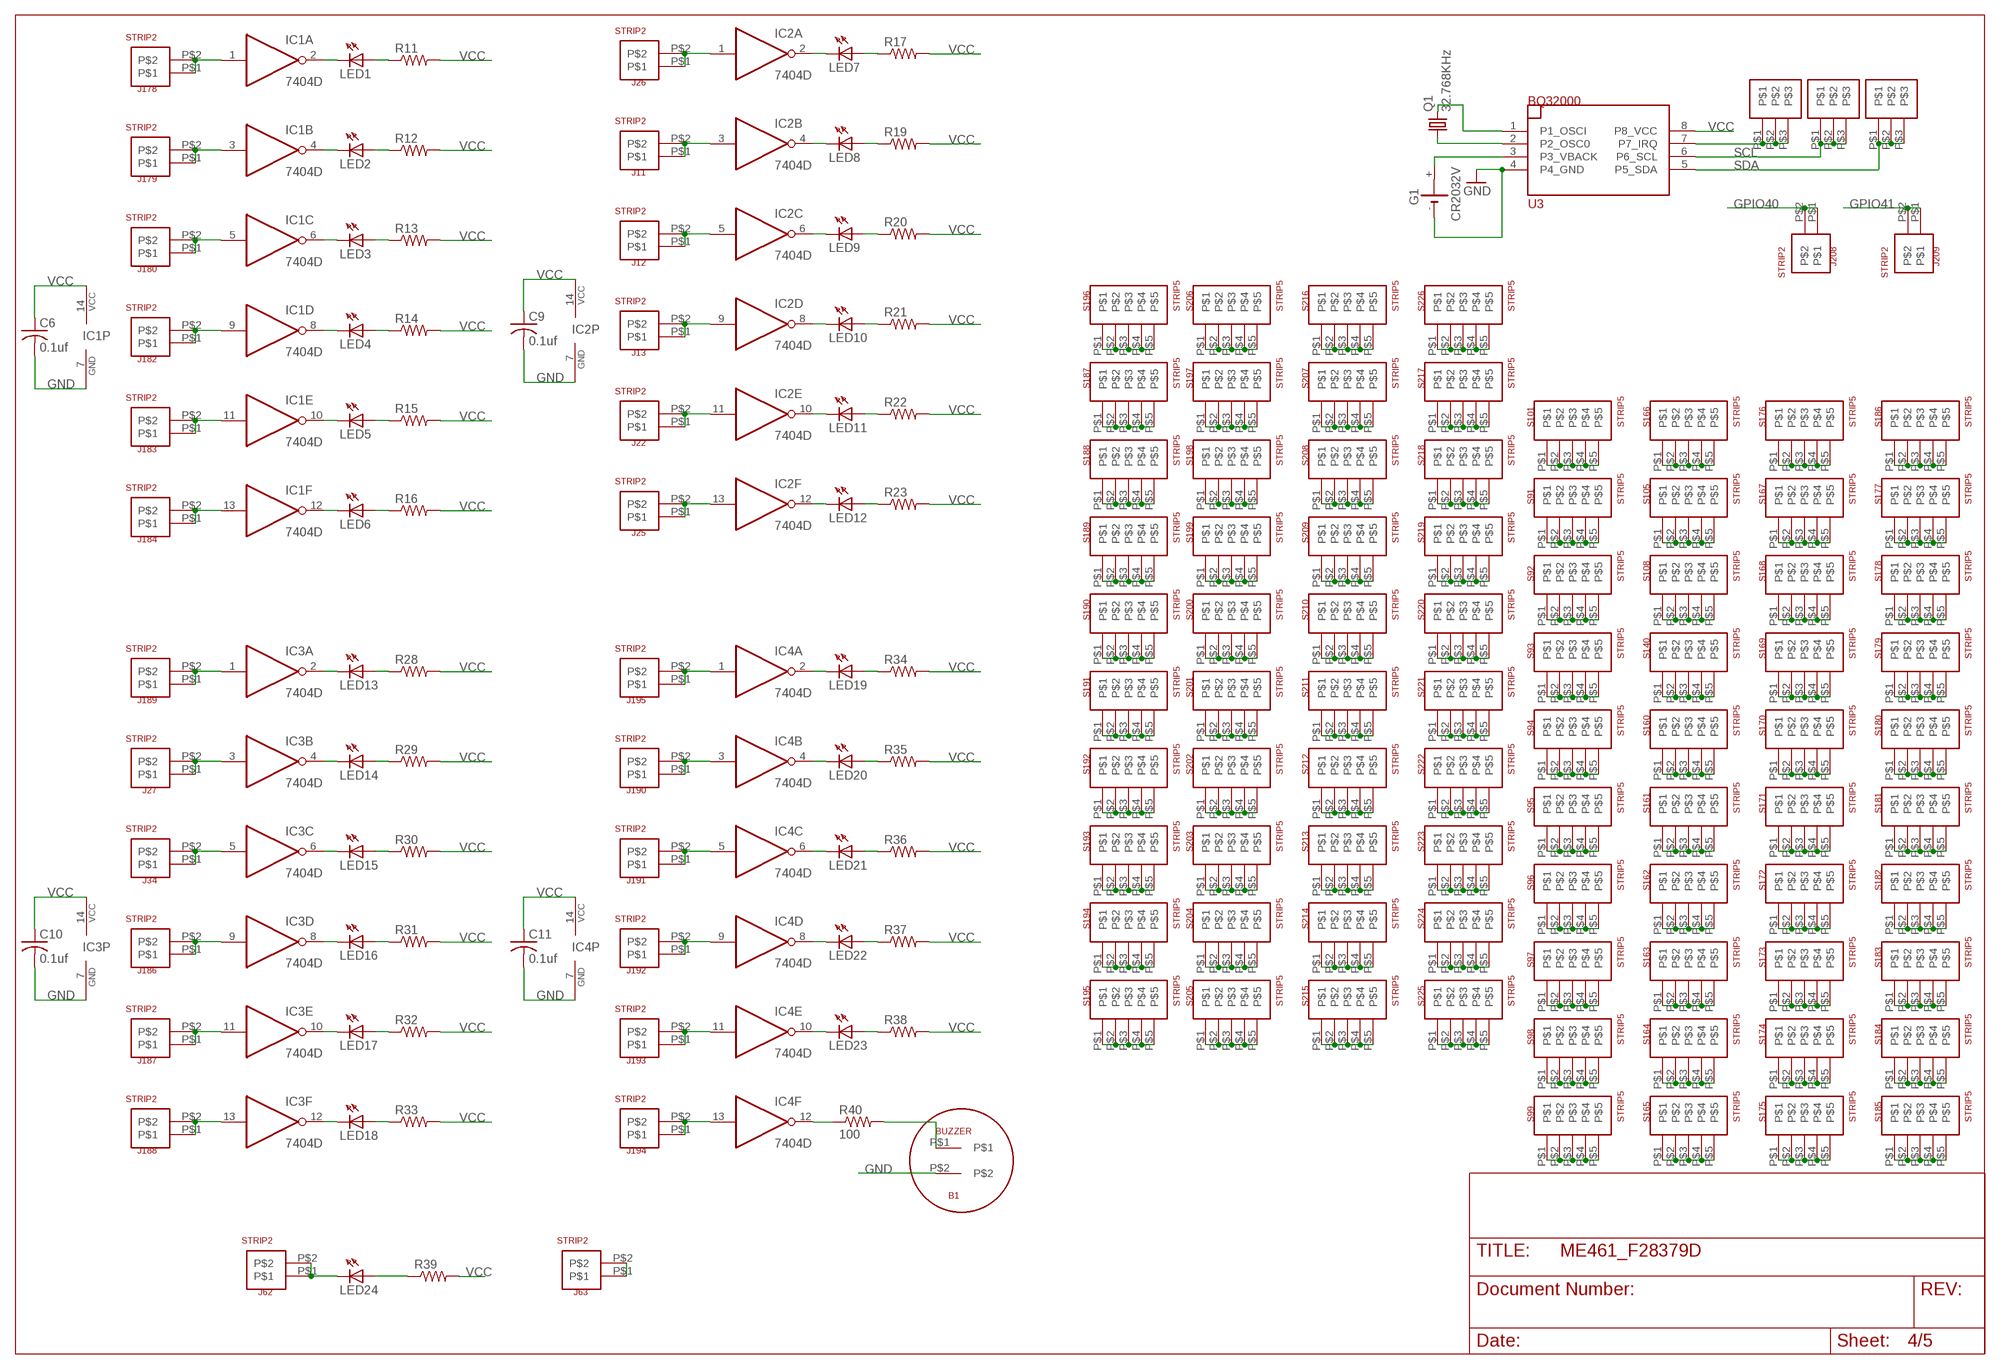
[diagram p3: schematic, sheet 4]

### Parts
B1  BUZZER  [BUZZER]
C6  0.1uf  C-USC1206  [C1206]
C9  0.1uf  C-USC1206  [C1206]
C10  0.1uf  C-USC1206  [C1206]
C11  0.1uf  C-USC1206  [C1206]
G1  CR2032V  [CR2032V]
IC1  7404D  [SO14]
IC2  7404D  [SO14]
IC3  7404D  [SO14]
IC4  7404D  [SO14]
J1  STRIP3  [STRIP3]
J2  STRIP3  [STRIP3]
J3  STRIP3  [STRIP3]
J11  STRIP2  [STRIP2]
J12  STRIP2  [STRIP2]
J13  STRIP2  [STRIP2]
J22  STRIP2  [STRIP2]
J25  STRIP2  [STRIP2]
J26  STRIP2  [STRIP2]
J27  STRIP2  [STRIP2]
J34  STRIP2  [STRIP2]
J62  STRIP2  [STRIP2]
J63  STRIP2  [STRIP2]
J178  STRIP2  [STRIP2]
J179  STRIP2  [STRIP2]
J180  STRIP2  [STRIP2]
J182  STRIP2  [STRIP2]
J183  STRIP2  [STRIP2]
J184  STRIP2  [STRIP2]
J186  STRIP2  [STRIP2]
J187  STRIP2  [STRIP2]
J188  STRIP2  [STRIP2]
J189  STRIP2  [STRIP2]
J190  STRIP2  [STRIP2]
J191  STRIP2  [STRIP2]
J192  STRIP2  [STRIP2]
J193  STRIP2  [STRIP2]
J194  STRIP2  [STRIP2]
J195  STRIP2  [STRIP2]
J208  STRIP2  [STRIP2]
J209  STRIP2  [STRIP2]
LED1  LED3MM  [LED3MM]
LED2  LED3MM  [LED3MM]
LED3  LED3MM  [LED3MM]
LED4  LED3MM  [LED3MM]
LED5  LED3MM  [LED3MM]
LED6  LED3MM  [LED3MM]
LED7  LED3MM  [LED3MM]
LED8  LED3MM  [LED3MM]
LED9  LED3MM  [LED3MM]
LED10  LED3MM  [LED3MM]
LED11  LED3MM  [LED3MM]
LED12  LED3MM  [LED3MM]
LED13  LED3MM  [LED3MM]
LED14  LED3MM  [LED3MM]
LED15  LED3MM  [LED3MM]
LED16  LED3MM  [LED3MM]
LED17  LED3MM  [LED3MM]
LED18  LED3MM  [LED3MM]
LED19  LED3MM  [LED3MM]
LED20  LED3MM  [LED3MM]
LED21  LED3MM  [LED3MM]
LED22  LED3MM  [LED3MM]
LED23  LED3MM  [LED3MM]
LED24  LED3MM  [LED3MM]
Q1  32.768KHz  CRYTALTC26H  [TC26H]
R11  R-US_R1206  [R1206]
R12  R-US_R1206  [R1206]
R13  R-US_R1206  [R1206]
R14  R-US_R1206  [R1206]
R15  R-US_R1206  [R1206]
R16  R-US_R1206  [R1206]
R17  R-US_R1206  [R1206]
R19  R-US_R1206  [R1206]
R20  R-US_R1206  [R1206]
R21  R-US_R1206  [R1206]
R22  R-US_R1206  [R1206]
R23  R-US_R1206  [R1206]
R28  R-US_R1206  [R1206]
R29  R-US_R1206  [R1206]
R30  R-US_R1206  [R1206]
R31  R-US_R1206  [R1206]
R32  R-US_R1206  [R1206]
R33  R-US_R1206  [R1206]
R34  R-US_R1206  [R1206]
R35  R-US_R1206  [R1206]
R36  R-US_R1206  [R1206]
R37  R-US_R1206  [R1206]
R38  R-US_R1206  [R1206]
R39  R-US_R1206  [R1206]
R40  100  R-US_R1206  [R1206]
S91  STRIP5  [STRIP5]
S92  STRIP5  [STRIP5]
S93  STRIP5  [STRIP5]
S94  STRIP5  [STRIP5]
S95  STRIP5  [STRIP5]
S96  STRIP5  [STRIP5]
S97  STRIP5  [STRIP5]
S98  STRIP5  [STRIP5]
S99  STRIP5  [STRIP5]
S101  STRIP5  [STRIP5]
S105  STRIP5  [STRIP5]
S108  STRIP5  [STRIP5]
S140  STRIP5  [STRIP5]
S160  STRIP5  [STRIP5]
S161  STRIP5  [STRIP5]
S162  STRIP5  [STRIP5]
S163  STRIP5  [STRIP5]
S164  STRIP5  [STRIP5]
S165  STRIP5  [STRIP5]
S166  STRIP5  [STRIP5]
S167  STRIP5  [STRIP5]
S168  STRIP5  [STRIP5]
S169  STRIP5  [STRIP5]
S170  STRIP5  [STRIP5]
S171  STRIP5  [STRIP5]
S172  STRIP5  [STRIP5]
S173  STRIP5  [STRIP5]
S174  STRIP5  [STRIP5]
S175  STRIP5  [STRIP5]
S176  STRIP5  [STRIP5]
S177  STRIP5  [STRIP5]
S178  STRIP5  [STRIP5]
S179  STRIP5  [STRIP5]
S180  STRIP5  [STRIP5]
S181  STRIP5  [STRIP5]
S182  STRIP5  [STRIP5]
S183  STRIP5  [STRIP5]
S184  STRIP5  [STRIP5]
S185  STRIP5  [STRIP5]
S186  STRIP5  [STRIP5]
S187  STRIP5  [STRIP5]
S188  STRIP5  [STRIP5]
S189  STRIP5  [STRIP5]
S190  STRIP5  [STRIP5]
S191  STRIP5  [STRIP5]
S192  STRIP5  [STRIP5]
S193  STRIP5  [STRIP5]
S194  STRIP5  [STRIP5]
S195  STRIP5  [STRIP5]
S196  STRIP5  [STRIP5]
S197  STRIP5  [STRIP5]
S198  STRIP5  [STRIP5]
S199  STRIP5  [STRIP5]
S200  STRIP5  [STRIP5]
S201  STRIP5  [STRIP5]
S202  STRIP5  [STRIP5]
S203  STRIP5  [STRIP5]
S204  STRIP5  [STRIP5]
S205  STRIP5  [STRIP5]
S206  STRIP5  [STRIP5]
S207  STRIP5  [STRIP5]
S208  STRIP5  [STRIP5]
S209  STRIP5  [STRIP5]
S210  STRIP5  [STRIP5]
S211  STRIP5  [STRIP5]
S212  STRIP5  [STRIP5]
S213  STRIP5  [STRIP5]
S214  STRIP5  [STRIP5]
S215  STRIP5  [STRIP5]
S216  STRIP5  [STRIP5]
S217  STRIP5  [STRIP5]
S218  STRIP5  [STRIP5]
S219  STRIP5  [STRIP5]
S220  STRIP5  [STRIP5]
S221  STRIP5  [STRIP5]
S222  STRIP5  [STRIP5]
S223  STRIP5  [STRIP5]
S224  STRIP5  [STRIP5]
S225  STRIP5  [STRIP5]
S226  STRIP5  [STRIP5]
U3  BQ32000  [SO08]

### Nets
GND [supply]: B1.P$2 C6.2 C9.2 C10.2 C11.2 G1.- IC1.7(P:GND) IC2.7(P:GND) IC3.7(P:GND) IC4.7(P:GND) U3.4(P4_GND) ; also sheet 1,2,3,5
GPIO40: J208.P$1 J208.P$2 ; also sheet 1
GPIO41: J209.P$1 J209.P$2 ; also sheet 1
N$47: J62.P$1 J62.P$2 LED24.K(C)
N$48: IC4.12(F:O) R40.1
N$50: B1.P$1 R40.2
N$51: Q1.1 U3.2(P2_OSC0)
N$52: J63.P$1 J63.P$2
N$70: Q1.2 U3.1(P1_OSCI)
N$118: J1.P$1 J1.P$2 J1.P$3 U3.7(P7_IRQ)
N$119: G1.+ U3.3(P3_VBACK)
N$156: IC2.1(A:I) J26.P$1 J26.P$2
N$157: IC2.2(A:O) LED7.K(C)
N$158: LED7.A R17.1
N$159: IC2.3(B:I) J11.P$1 J11.P$2
N$160: IC2.4(B:O) LED8.K(C)
N$161: LED8.A R19.1
N$163: IC2.5(C:I) J12.P$1 J12.P$2
N$164: IC2.6(C:O) LED9.K(C)
N$248: S91.P$1 S91.P$2 S91.P$3 S91.P$4 S91.P$5
N$249: S92.P$1 S92.P$2 S92.P$3 S92.P$4 S92.P$5
N$250: S93.P$1 S93.P$2 S93.P$3 S93.P$4 S93.P$5
N$251: S94.P$1 S94.P$2 S94.P$3 S94.P$4 S94.P$5
N$252: S95.P$1 S95.P$2 S95.P$3 S95.P$4 S95.P$5
N$253: S96.P$1 S96.P$2 S96.P$3 S96.P$4 S96.P$5
N$254: S97.P$1 S97.P$2 S97.P$3 S97.P$4 S97.P$5
N$255: S98.P$1 S98.P$2 S98.P$3 S98.P$4 S98.P$5
N$256: S99.P$1 S99.P$2 S99.P$3 S99.P$4 S99.P$5
N$257: S101.P$1 S101.P$2 S101.P$3 S101.P$4 S101.P$5
N$258: S105.P$1 S105.P$2 S105.P$3 S105.P$4 S105.P$5
N$259: S108.P$1 S108.P$2 S108.P$3 S108.P$4 S108.P$5
N$260: S140.P$1 S140.P$2 S140.P$3 S140.P$4 S140.P$5
N$261: S160.P$1 S160.P$2 S160.P$3 S160.P$4 S160.P$5
N$262: S161.P$1 S161.P$2 S161.P$3 S161.P$4 S161.P$5
N$263: S162.P$1 S162.P$2 S162.P$3 S162.P$4 S162.P$5
N$264: S163.P$1 S163.P$2 S163.P$3 S163.P$4 S163.P$5
N$265: S164.P$1 S164.P$2 S164.P$3 S164.P$4 S164.P$5
N$266: S165.P$1 S165.P$2 S165.P$3 S165.P$4 S165.P$5
N$267: S166.P$1 S166.P$2 S166.P$3 S166.P$4 S166.P$5
N$268: S167.P$1 S167.P$2 S167.P$3 S167.P$4 S167.P$5
N$269: S168.P$1 S168.P$2 S168.P$3 S168.P$4 S168.P$5
N$270: S169.P$1 S169.P$2 S169.P$3 S169.P$4 S169.P$5
N$271: S170.P$1 S170.P$2 S170.P$3 S170.P$4 S170.P$5
N$272: S171.P$1 S171.P$2 S171.P$3 S171.P$4 S171.P$5
N$273: S172.P$1 S172.P$2 S172.P$3 S172.P$4 S172.P$5
N$274: S173.P$1 S173.P$2 S173.P$3 S173.P$4 S173.P$5
N$275: S174.P$1 S174.P$2 S174.P$3 S174.P$4 S174.P$5
N$276: S175.P$1 S175.P$2 S175.P$3 S175.P$4 S175.P$5
N$277: S176.P$1 S176.P$2 S176.P$3 S176.P$4 S176.P$5
N$278: S177.P$1 S177.P$2 S177.P$3 S177.P$4 S177.P$5
N$279: S178.P$1 S178.P$2 S178.P$3 S178.P$4 S178.P$5
N$280: S179.P$1 S179.P$2 S179.P$3 S179.P$4 S179.P$5
N$281: S180.P$1 S180.P$2 S180.P$3 S180.P$4 S180.P$5
N$282: S181.P$1 S181.P$2 S181.P$3 S181.P$4 S181.P$5
N$283: S182.P$1 S182.P$2 S182.P$3 S182.P$4 S182.P$5
N$284: S183.P$1 S183.P$2 S183.P$3 S183.P$4 S183.P$5
N$285: S184.P$1 S184.P$2 S184.P$3 S184.P$4 S184.P$5
N$286: S185.P$1 S185.P$2 S185.P$3 S185.P$4 S185.P$5
N$287: S186.P$1 S186.P$2 S186.P$3 S186.P$4 S186.P$5
N$288: S187.P$1 S187.P$2 S187.P$3 S187.P$4 S187.P$5
N$289: S188.P$1 S188.P$2 S188.P$3 S188.P$4 S188.P$5
N$290: S189.P$1 S189.P$2 S189.P$3 S189.P$4 S189.P$5
N$291: S190.P$1 S190.P$2 S190.P$3 S190.P$4 S190.P$5
N$292: S191.P$1 S191.P$2 S191.P$3 S191.P$4 S191.P$5
N$293: S192.P$1 S192.P$2 S192.P$3 S192.P$4 S192.P$5
N$294: S193.P$1 S193.P$2 S193.P$3 S193.P$4 S193.P$5
N$295: S194.P$1 S194.P$2 S194.P$3 S194.P$4 S194.P$5
N$296: S195.P$1 S195.P$2 S195.P$3 S195.P$4 S195.P$5
N$297: S196.P$1 S196.P$2 S196.P$3 S196.P$4 S196.P$5
N$298: S197.P$1 S197.P$2 S197.P$3 S197.P$4 S197.P$5
N$299: S198.P$1 S198.P$2 S198.P$3 S198.P$4 S198.P$5
N$300: S199.P$1 S199.P$2 S199.P$3 S199.P$4 S199.P$5
N$301: S200.P$1 S200.P$2 S200.P$3 S200.P$4 S200.P$5
N$302: S201.P$1 S201.P$2 S201.P$3 S201.P$4 S201.P$5
N$303: S202.P$1 S202.P$2 S202.P$3 S202.P$4 S202.P$5
N$304: S203.P$1 S203.P$2 S203.P$3 S203.P$4 S203.P$5
N$305: S204.P$1 S204.P$2 S204.P$3 S204.P$4 S204.P$5
N$306: S205.P$1 S205.P$2 S205.P$3 S205.P$4 S205.P$5
N$307: S206.P$1 S206.P$2 S206.P$3 S206.P$4 S206.P$5
N$308: S207.P$1 S207.P$2 S207.P$3 S207.P$4 S207.P$5
N$309: S208.P$1 S208.P$2 S208.P$3 S208.P$4 S208.P$5
N$310: S209.P$1 S209.P$2 S209.P$3 S209.P$4 S209.P$5
N$311: S210.P$1 S210.P$2 S210.P$3 S210.P$4 S210.P$5
N$312: S211.P$1 S211.P$2 S211.P$3 S211.P$4 S211.P$5
N$313: S212.P$1 S212.P$2 S212.P$3 S212.P$4 S212.P$5
N$314: S213.P$1 S213.P$2 S213.P$3 S213.P$4 S213.P$5
N$315: S214.P$1 S214.P$2 S214.P$3 S214.P$4 S214.P$5
N$316: S215.P$1 S215.P$2 S215.P$3 S215.P$4 S215.P$5
N$317: S216.P$1 S216.P$2 S216.P$3 S216.P$4 S216.P$5
N$318: S217.P$1 S217.P$2 S217.P$3 S217.P$4 S217.P$5
N$319: S218.P$1 S218.P$2 S218.P$3 S218.P$4 S218.P$5
N$320: S219.P$1 S219.P$2 S219.P$3 S219.P$4 S219.P$5
N$321: S220.P$1 S220.P$2 S220.P$3 S220.P$4 S220.P$5
N$322: S221.P$1 S221.P$2 S221.P$3 S221.P$4 S221.P$5
N$323: S222.P$1 S222.P$2 S222.P$3 S222.P$4 S222.P$5
N$324: S223.P$1 S223.P$2 S223.P$3 S223.P$4 S223.P$5
N$325: S224.P$1 S224.P$2 S224.P$3 S224.P$4 S224.P$5
N$326: S225.P$1 S225.P$2 S225.P$3 S225.P$4 S225.P$5
N$327: S226.P$1 S226.P$2 S226.P$3 S226.P$4 S226.P$5
N$343: IC1.1(A:I) J178.P$1 J178.P$2
N$344: IC1.2(A:O) LED1.K(C)
N$345: LED1.A R11.1
N$346: IC1.3(B:I) J179.P$1 J179.P$2
N$347: IC1.4(B:O) LED2.K(C)
N$348: LED2.A R12.1
N$349: IC1.5(C:I) J180.P$1 J180.P$2
N$350: IC1.6(C:O) LED3.K(C)
N$351: LED3.A R13.1
N$352: IC1.9(D:I) J182.P$1 J182.P$2
N$353: IC1.8(D:O) LED4.K(C)
N$354: LED4.A R14.1
N$355: IC1.11(E:I) J183.P$1 J183.P$2
N$356: IC1.10(E:O) LED5.K(C)
N$357: LED5.A R15.1
N$358: IC1.13(F:I) J184.P$1 J184.P$2
N$359: IC1.12(F:O) LED6.K(C)
N$360: LED6.A R16.1
N$361: LED9.A R20.1
N$362: IC2.9(D:I) J13.P$1 J13.P$2
N$363: IC2.8(D:O) LED10.K(C)
N$364: LED10.A R21.1
N$365: IC2.11(E:I) J22.P$1 J22.P$2
N$366: IC2.10(E:O) LED11.K(C)
N$367: LED11.A R22.1
N$368: IC2.13(F:I) J25.P$1 J25.P$2
N$369: IC2.12(F:O) LED12.K(C)
N$370: LED12.A R23.1
N$371: IC3.1(A:I) J189.P$1 J189.P$2
N$372: IC3.2(A:O) LED13.K(C)
N$373: LED13.A R28.1
N$374: IC3.3(B:I) J27.P$1 J27.P$2
N$375: IC3.4(B:O) LED14.K(C)
N$376: LED14.A R29.1
N$377: IC3.5(C:I) J34.P$1 J34.P$2
N$378: IC3.6(C:O) LED15.K(C)
N$379: LED15.A R30.1
N$380: IC3.9(D:I) J186.P$1 J186.P$2
N$381: IC3.8(D:O) LED16.K(C)
N$382: LED16.A R31.1
N$383: IC3.11(E:I) J187.P$1 J187.P$2
N$384: IC3.10(E:O) LED17.K(C)
N$385: LED17.A R32.1
N$386: IC3.13(F:I) J188.P$1 J188.P$2
N$387: IC3.12(F:O) LED18.K(C)
N$388: LED18.A R33.1
N$389: IC4.1(A:I) J195.P$1 J195.P$2
N$390: IC4.2(A:O) LED19.K(C)
N$391: LED19.A R34.1
N$392: IC4.3(B:I) J190.P$1 J190.P$2
N$393: IC4.4(B:O) LED20.K(C)
N$394: LED20.A R35.1
N$395: IC4.5(C:I) J191.P$1 J191.P$2
N$396: IC4.6(C:O) LED21.K(C)
N$397: LED21.A R36.1
N$398: IC4.9(D:I) J192.P$1 J192.P$2
N$399: IC4.8(D:O) LED22.K(C)
N$400: LED22.A R37.1
N$401: IC4.11(E:I) J193.P$1 J193.P$2
N$402: IC4.10(E:O) LED23.K(C)
N$403: LED23.A R38.1
N$404: IC4.13(F:I) J194.P$1 J194.P$2
N$406: LED24.A R39.1
SCL: J2.P$1 J2.P$2 J2.P$3 U3.6(P6_SCL)
SDA: J3.P$1 J3.P$2 J3.P$3 U3.5(P5_SDA)
VCC [supply]: C6.1 C9.1 C10.1 C11.1 IC1.14(P:VCC) IC2.14(P:VCC) IC3.14(P:VCC) IC4.14(P:VCC) R11.2 R12.2 R13.2 R14.2 R15.2 R16.2 R17.2 R19.2 R20.2 R21.2 R22.2 R23.2 R28.2 R29.2 R30.2 R31.2 R32.2 R33.2 R34.2 R35.2 R36.2 R37.2 R38.2 R39.2 U3.8(P8_VCC) ; also sheet 1,2,3,5
Unconnected: G1.+@1(+)

## Sheet 5 of 5
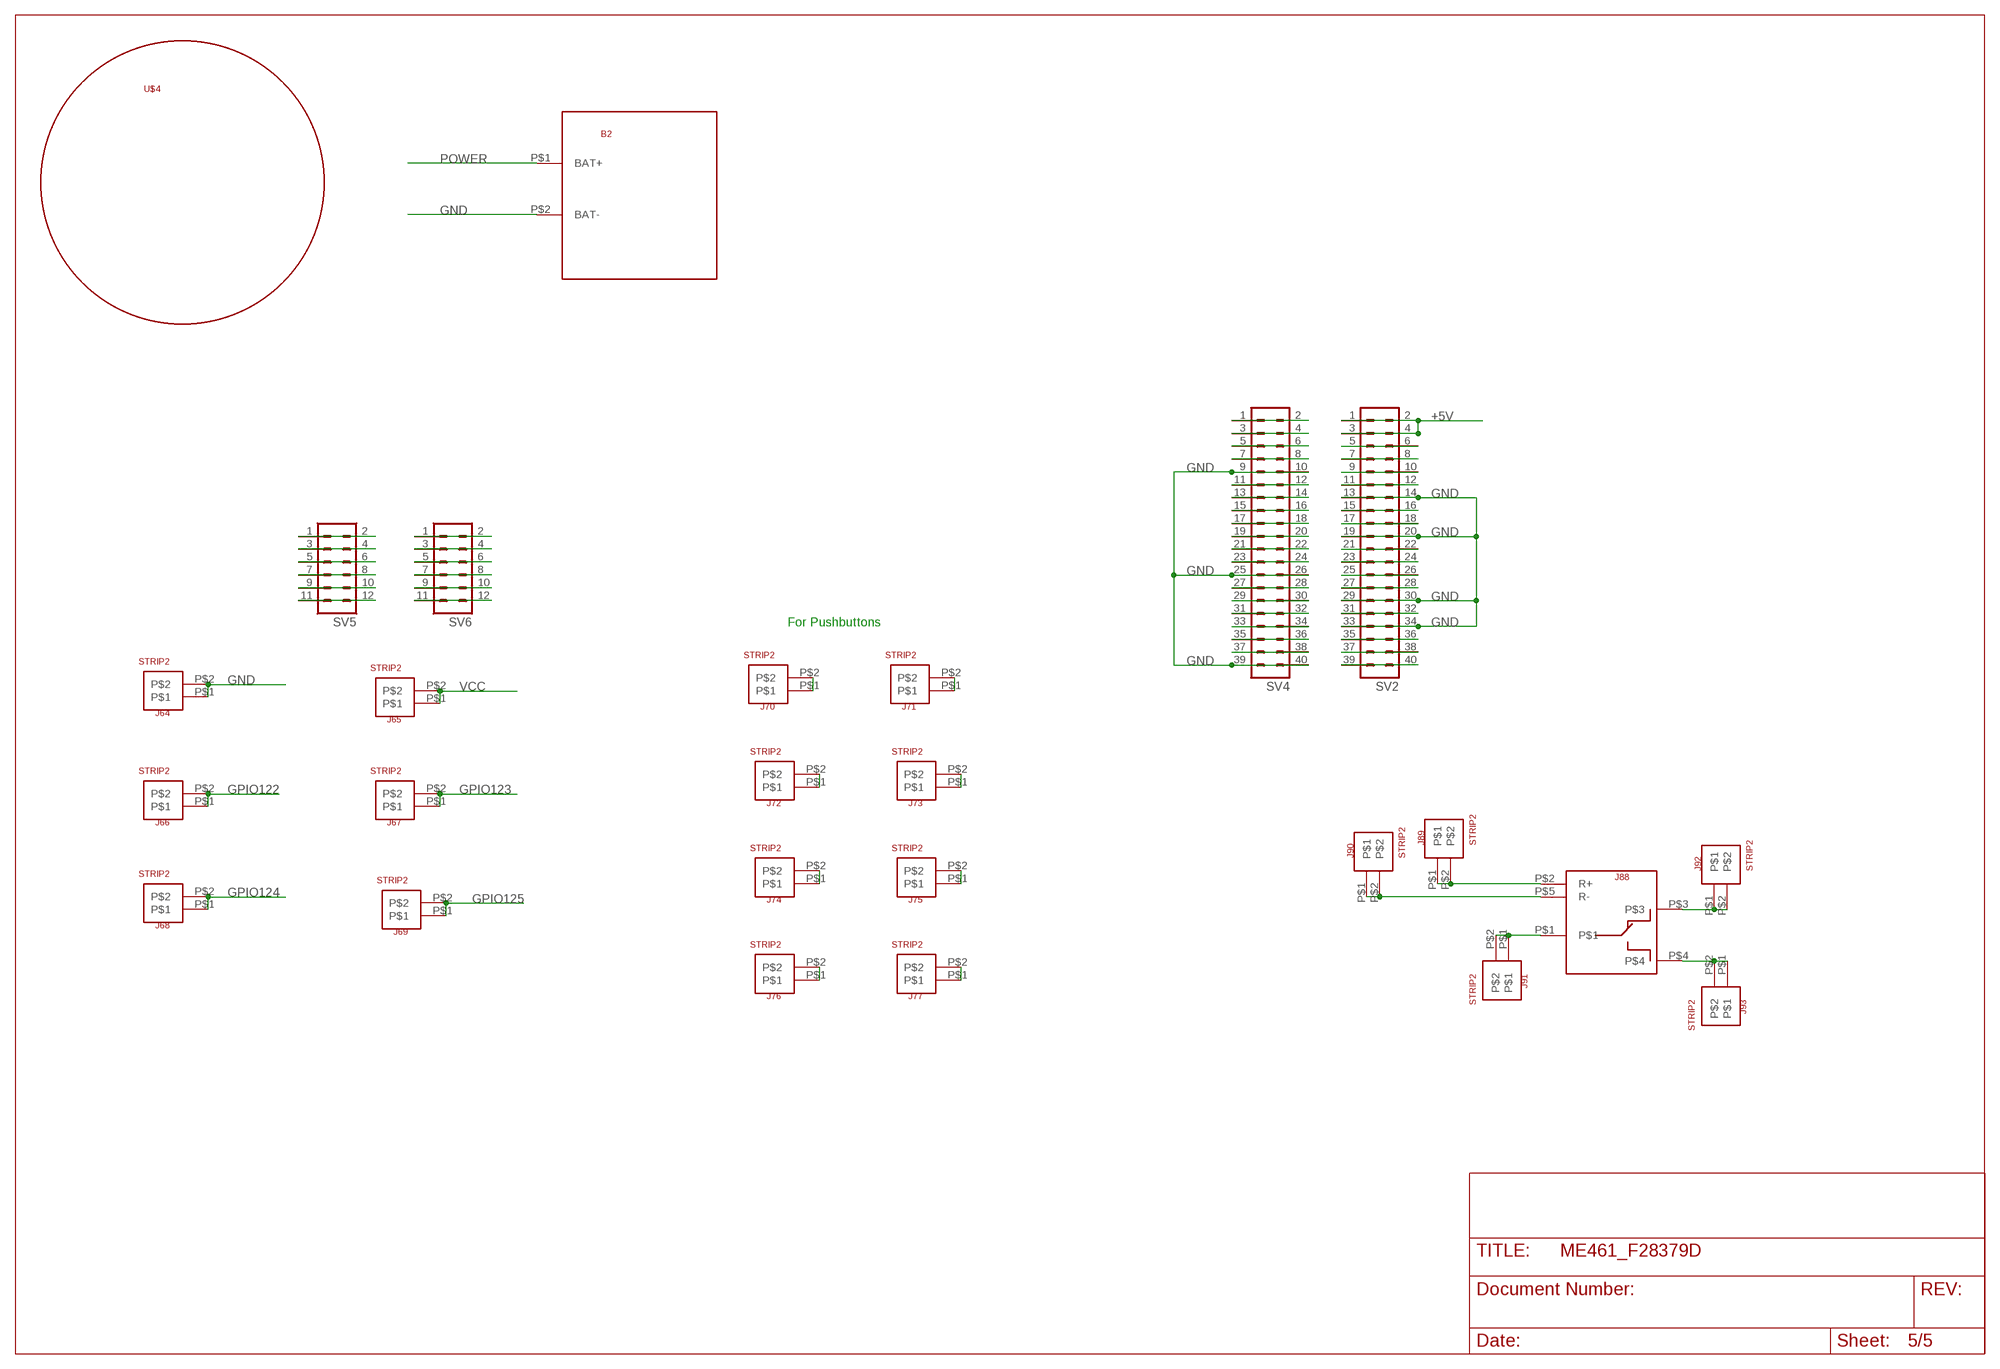
[diagram p4: schematic, sheet 5]

### Parts
B2  BATTERY_4AA_HOLDER  [BATTERY_4AA_HOLDER]
J64  STRIP2  [STRIP2]
J65  STRIP2  [STRIP2]
J66  STRIP2  [STRIP2]
J67  STRIP2  [STRIP2]
J68  STRIP2  [STRIP2]
J69  STRIP2  [STRIP2]
J70  STRIP2  [STRIP2]
J71  STRIP2  [STRIP2]
J72  STRIP2  [STRIP2]
J73  STRIP2  [STRIP2]
J74  STRIP2  [STRIP2]
J75  STRIP2  [STRIP2]
J76  STRIP2  [STRIP2]
J77  STRIP2  [STRIP2]
J88  RELAY_JQC-3F_5V  [RELAY_JQC-3F_5V]
J89  STRIP2  [STRIP2]
J90  STRIP2  [STRIP2]
J91  STRIP2  [STRIP2]
J92  STRIP2  [STRIP2]
J93  STRIP2  [STRIP2]
SV2  MA20-2  [MA20-2]
SV4  MA20-2  [MA20-2]
SV5  MA06-2  [MA06-2]
SV6  MA06-2  [MA06-2]
U$4  CASTERWHEEL  [CASTERWHEEL]

### Nets
+5V [supply]: SV2.1 SV2.2 SV2.3 SV2.4 ; also sheet 1,2,3
GND [supply]: B2.P$2(BAT-) J64.P$1 J64.P$2 SV2.13 SV2.14 SV2.19 SV2.20 SV2.29 SV2.30 SV2.33 SV2.34 SV4.9 SV4.10 SV4.25 SV4.26 SV4.39 SV4.40 ; also sheet 1,2,3,4
GPIO122: J66.P$1 J66.P$2 ; also sheet 1
GPIO123: J67.P$1 J67.P$2 ; also sheet 1
GPIO124: J68.P$1 J68.P$2 ; also sheet 1
GPIO125: J69.P$1 J69.P$2 ; also sheet 1
N$49: SV4.1 SV4.2
N$54: SV5.1 SV5.2
N$58: SV5.3 SV5.4
N$61: SV5.5 SV5.6
N$71: SV4.3 SV4.4
N$72: SV4.5 SV4.6
N$73: SV4.7 SV4.8
N$74: SV5.7 SV5.8
N$75: SV4.11 SV4.12
N$76: SV4.13 SV4.14
N$77: SV4.15 SV4.16
N$78: SV4.17 SV4.18
N$79: SV4.19 SV4.20
N$80: SV4.21 SV4.22
N$120: SV4.23 SV4.24
N$121: SV5.9 SV5.10
N$122: SV4.27 SV4.28
N$123: SV4.29 SV4.30
N$124: SV4.31 SV4.32
N$126: SV4.33 SV4.34
N$128: SV4.35 SV4.36
N$134: SV4.37 SV4.38
N$135: SV5.11 SV5.12
N$136: SV2.39 SV2.40
N$137: SV2.37 SV2.38
N$138: SV2.35 SV2.36
N$139: SV6.1 SV6.2
N$140: SV2.31 SV2.32
N$141: SV6.3 SV6.4
N$142: SV2.27 SV2.28
N$143: SV2.25 SV2.26
N$144: SV2.23 SV2.24
N$145: SV2.21 SV2.22
N$146: SV6.5 SV6.6
N$147: SV2.17 SV2.18
N$148: SV2.15 SV2.16
N$149: SV6.7 SV6.8
N$150: SV2.11 SV2.12
N$151: SV2.9 SV2.10
N$152: SV2.7 SV2.8
N$153: SV2.5 SV2.6
N$154: SV6.9 SV6.10
N$155: SV6.11 SV6.12
N$162: J70.P$1 J70.P$2
N$167: J71.P$1 J71.P$2
N$168: J72.P$1 J72.P$2
N$169: J73.P$1 J73.P$2
N$170: J74.P$1 J74.P$2
N$171: J75.P$1 J75.P$2
N$173: J76.P$1 J76.P$2
N$174: J77.P$1 J77.P$2
N$193: J88.P$2(R+) J89.P$1 J89.P$2
N$194: J88.P$5(R-) J90.P$1 J90.P$2
N$195: J88.P$1 J91.P$1 J91.P$2
N$196: J88.P$3 J92.P$1 J92.P$2
N$197: J88.P$4 J93.P$1 J93.P$2
POWER [supply]: B2.P$1(BAT+) ; also sheet 1,3
VCC [supply]: J65.P$1 J65.P$2 ; also sheet 1,2,3,4

### Notes on the sheet
- For Pushbuttons

## Library data of the parts
B1 = SE423EagleLibrary:BUZZER
B2 = SE423EagleLibrary:BATTERY_4AA_HOLDER
C1 C7 C12 C13 C15 C20 C21 C25 C27 C28 = rcl:CPOL-US: POLARIZED CAPACITOR, American symbol
C2-C6 C8-C11 C14 C16-C19 C22-C24 C26 = rcl:C-US: CAPACITOR, American symbol
DCDC3.3V DCDC5V JP1 = pinhead:PINHD-1X3: PIN HEADER
G1 = battery:CR2032V: LI BATTERY Varta
IC1-IC4 = 74xx-us:74*04: Hex INVERTER
J1-J4 J6 J10 J14-J21 J23 J24 J28-J33 J49 J98-J170 J176 J177 = strip:STRIP3
J5 = POWER-IN:JACK-PMS
J7-J9 J11-J13 J22 J25-J27 J34 J62-J87 J89-J93 J178-J180 J182-J184 J186-J211 J232-J253 = strip:STRIP2
J88 = SE423EagleLibrary:RELAY_JQC-3F_5V
JP2 JP3 = jumper:JP1E: JUMPER
L1 = SE423EagleLibrary:F28379D_LAUNCHPAD
LED1-LED24 LED_3.3V1 LED_5V1 = led:LED: LED
M1 = custom:WM_64_MIC
POWER = pinhead:PINHD-1X2: PIN HEADER
Q1 = crystal:CRYTAL: CRYSTAL
R1-R44 = rcl:R-US_: RESISTOR, American symbol
S17 S18 S91-S99 S101 S105 S108 S129 S130 S137-S141 S147 S160-S226 = custom:STRIP5
S20 S24 S27 S28 S42 S50 S53 S58 = custom:STRIP10
S159 = switch_slide:SWITCH_SLIDE
SV1 SV3 SV7 SV8 TRIMPOT1 TRIMPOT2 = con-lstb:MA03-2: PIN HEADER; OC_FARNELL: unknown; OC_NEWARK: unknown
SV2 SV4 = con-lstb:MA20-2: PIN HEADER; OC_FARNELL: unknown; OC_NEWARK: unknown
SV5 SV6 = con-lstb:MA06-2: PIN HEADER; OC_FARNELL: unknown; OC_NEWARK: unknown
T1 T2 = keres:TIP125: PNP Transistor
U1 U5 = custom:A3953
U2 U4 = SE423EagleLibrary:DRV8874
U3 = custom6:BQ32000
U6 = custom4:TL1963A-33KTTR
U7 = custom4:TL1963A-KTTR
U8 = LM386:LM386
U$1 = MPU-9250_Breakoutboard:MPU-9250-BB
U$2 U$3 = SE423EagleLibrary:GEARMOTOR_MOUNT
U$4 = SE423EagleLibrary:CASTERWHEEL

## Net classes
0 default: width 0.203 mm, drill 0.508 mm, clearance 0.203 mm
1 supply: width 0.61 mm, drill 0.508 mm, clearance 0.203 mm